# EAGLE design untitled (EAGLE 6.1)
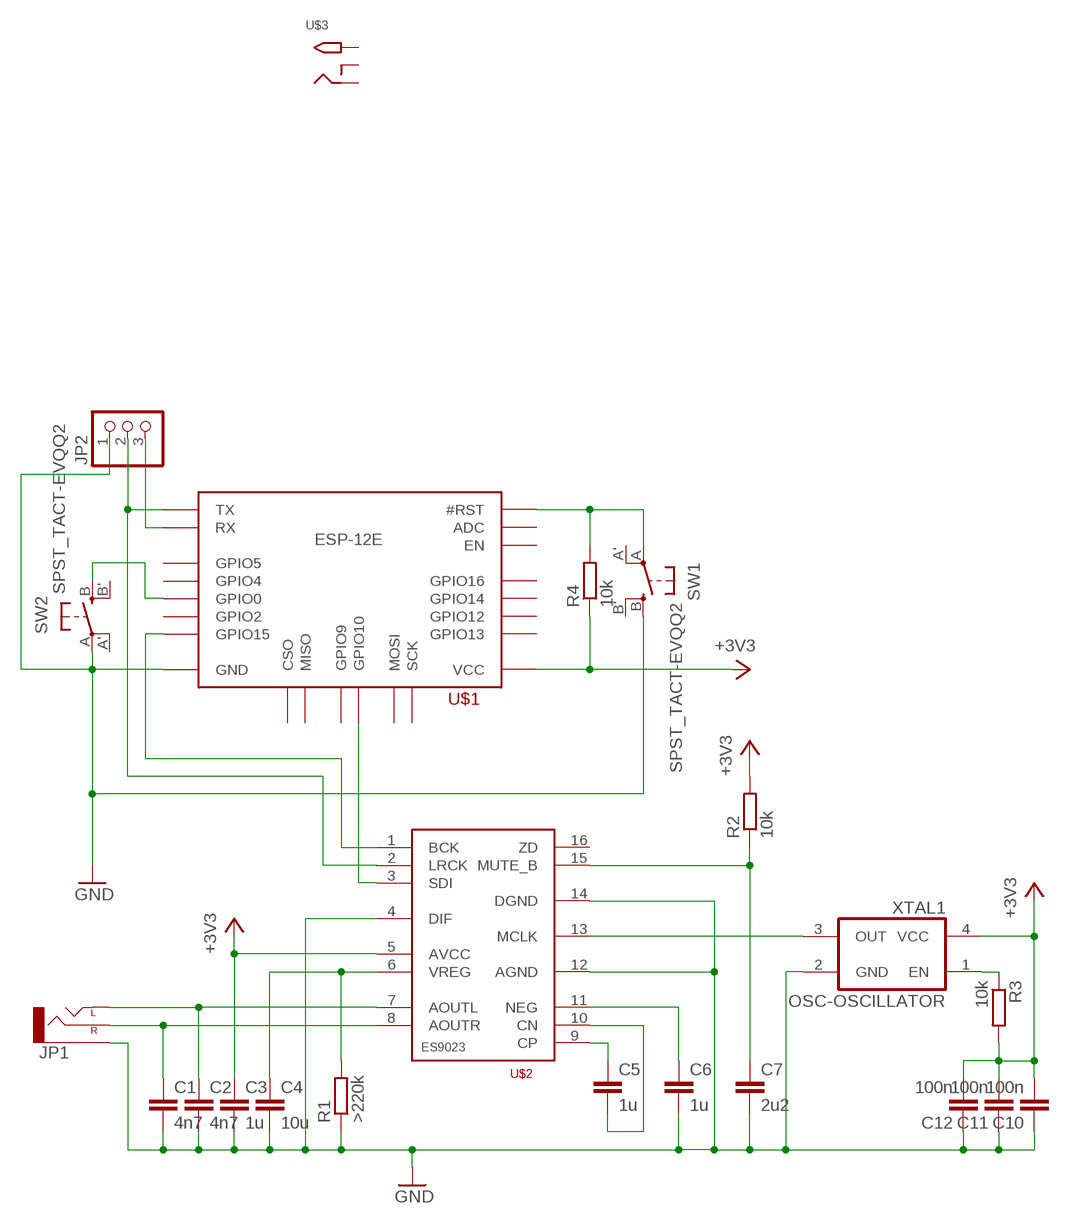
[diagram p0: schematic, sheet 1]

## Parts
C1  4n7  C-EUC0805K  [C0805K]
C2  4n7  C-EUC0805K  [C0805K]
C3  1u  C-EUC0805K  [C0805K]
C4  10u  C-EUC0805K  [C0805K]
C5  1u  C-EUC0805K  [C0805K]
C6  1u  C-EUC0805K  [C0805K]
C7  2u2  C-EUC0805K  [C0805K]
C10  100n  C-EUC0805K  [C0805K]
C11  100n  C-EUC0805K  [C0805K]
C12  100n  C-EUC0805K  [C0805K]
JP1  AUDIO-JACKPIN-HOLES  [AUDIO-JACK-HOLES]
JP2  PINHD-1X3  [1X03]
R1  >220k  R-EU_M0805  [M0805]
R2  10k  R-EU_M0805  [M0805]
R3  10k  R-EU_M0805  [M0805]
R4  10k  R-EU_M0805  [M0805]
SW1  SPST_TACT-EVQQ2  [EVQ-Q2]
SW2  SPST_TACT-EVQQ2  [EVQ-Q2]
U$1  ESP-07/12_ESP-12E  [ESP-07/12]
U$2  ES9023-SMD  [SOP16]
U$3  2.1MMJACKTHM  [PJ-102A]
XTAL1  OSC-OSCILLATOR  [OSCILLATOR_7X5_SMD]

## Nets
+3V3: C3.1 C10.2 C11.2 C12.2 R2.2 R3.2 R4.1 U$1.VCC U$2.5(AVCC) XTAL1.4(VCC)
GND: C1.2 C2.2 C3.2 C4.2 C6.2 C7.2 C10.1 C11.1 C12.1 JP1.GND(SLEEVE) JP2.1 R1.1 SW1.B(S) SW2.A(P) U$1.GND U$2.4(DIF) U$2.12(AGND) U$2.14(DGND) XTAL1.2(GND)
N$1: R3.1 XTAL1.1(EN)
N$2: R4.2 SW1.A(P) U$1.REST(#RST)
N$3: C4.1 R1.2 U$2.6(VREG)
N$4: C5.1 U$2.9(CP)
N$5: C5.2 U$2.10(CN)
N$6: C6.1 U$2.11(NEG)
N$7: C7.1 R2.1 U$2.15(MUTE_B)
N$8: SW2.B(S) U$1.GPIO0
N$9: U$1.GPIO15 U$2.1(BCK)
N$10: C1.1 JP1.R+(RIGHT) U$2.8(AOUTR)
N$11: C2.1 JP1.L1-(LEFT) JP1.L2-(LEFT) U$2.7(AOUTL)
N$12: JP2.2 U$1.TXD0(TX) U$2.2(LRCK)
N$13: JP2.3 U$1.RXD0(RX)
N$14: U$1.GPIO10 U$2.3(SDI)
N$15: U$2.13(MCLK) XTAL1.3(OUT)
Unconnected: SW1.A'(P1) SW1.B'(S1) SW2.A'(P1) SW2.B'(S1) U$1.ADC U$1.CSO U$1.EN U$1.GPIO2 U$1.GPIO4 U$1.GPIO5 U$1.GPIO9 U$1.GPIO12 U$1.GPIO13 U$1.GPIO14 U$1.GPIO16 U$1.MISO U$1.MOSI U$1.SCLK(SCK) U$2.16(ZD) U$3.RING U$3.RING_SW U$3.TIP

## Library data of the parts
C1-C7 C10-C12 = rcl:C-EU: CAPACITOR, European symbol
JP1 = _MY_OWN_LIB:AUDIO-JACK: 3.5mm Audio Jack Simple 3.5mm common PCB mount audio jack. SKU: PRT-08032
JP2 = pinhead:PINHD-1X3: PIN HEADER
R1-R4 = rcl:R-EU_: RESISTOR, European symbol
SW1 SW2 = adafruit:SPST_TACT: SMT 6mm switch, EVQQ2 series http://www.ladyada.net/library/eagle
U$1 = _MY_OWN_LIB:ESP-07/12: Version 1.0 of the library for the ESP-07/12 full GPIO dev board module byME Jon jonnyradu@gmail.com
U$2 = _MY_OWN_LIB:ES9023
U$3 = adafruit:2.1MMJACK: 2.1mm x 5.5mm THM DC jack with internal switch. Digikey part #PJ-102A, 4UCON part #05537 2.1mm x 5.5mm SMT DC jack with internal switch. Digikey part #PJ-002A-SMT, 4UCON part #03267 By microbuilder.eu & adafruit.com
XTAL1 = dp_devices:OSC-OSCILLATOR: Oscillator

## Board
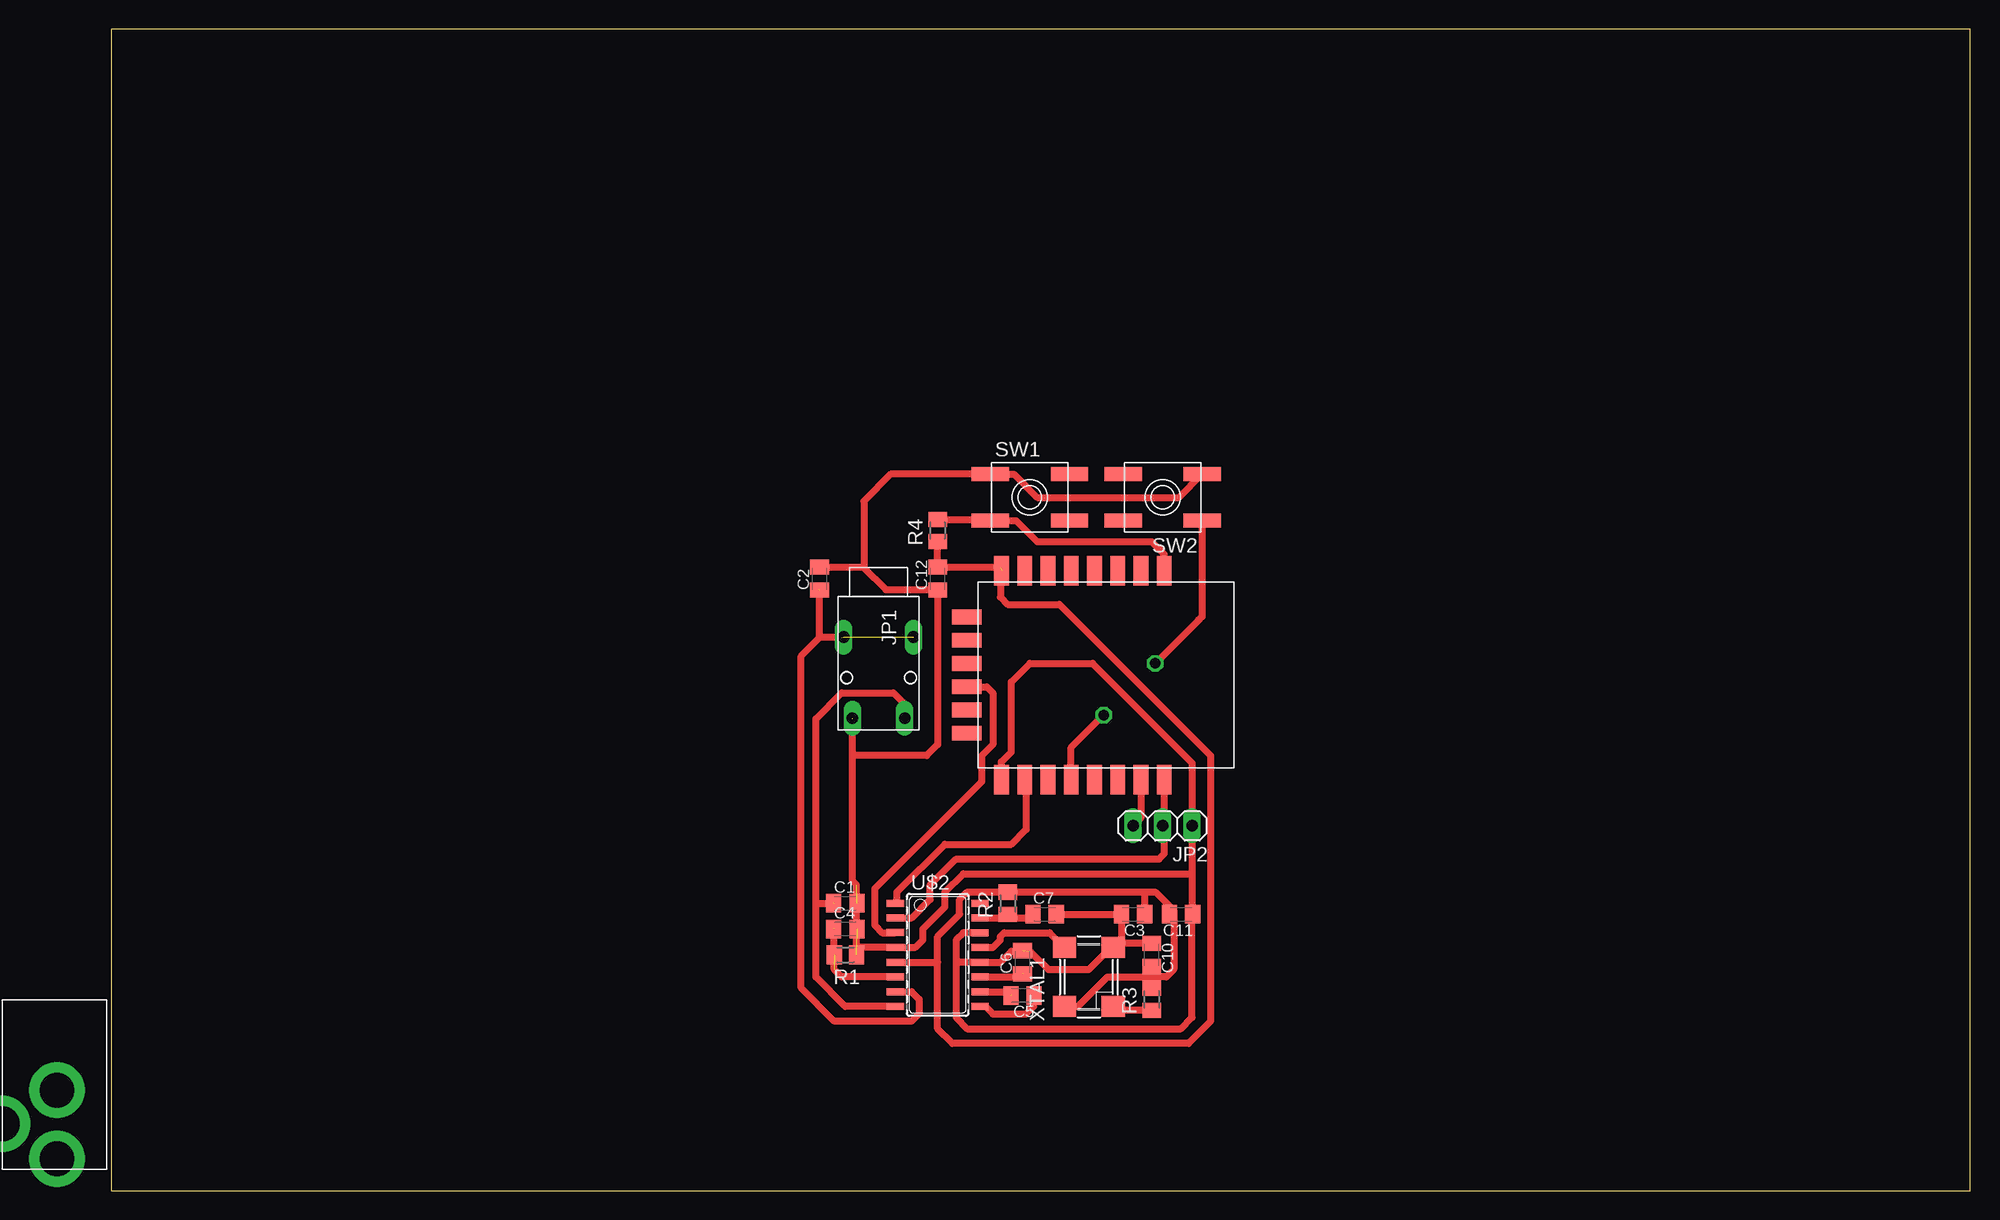
[diagram p1: board, top side]
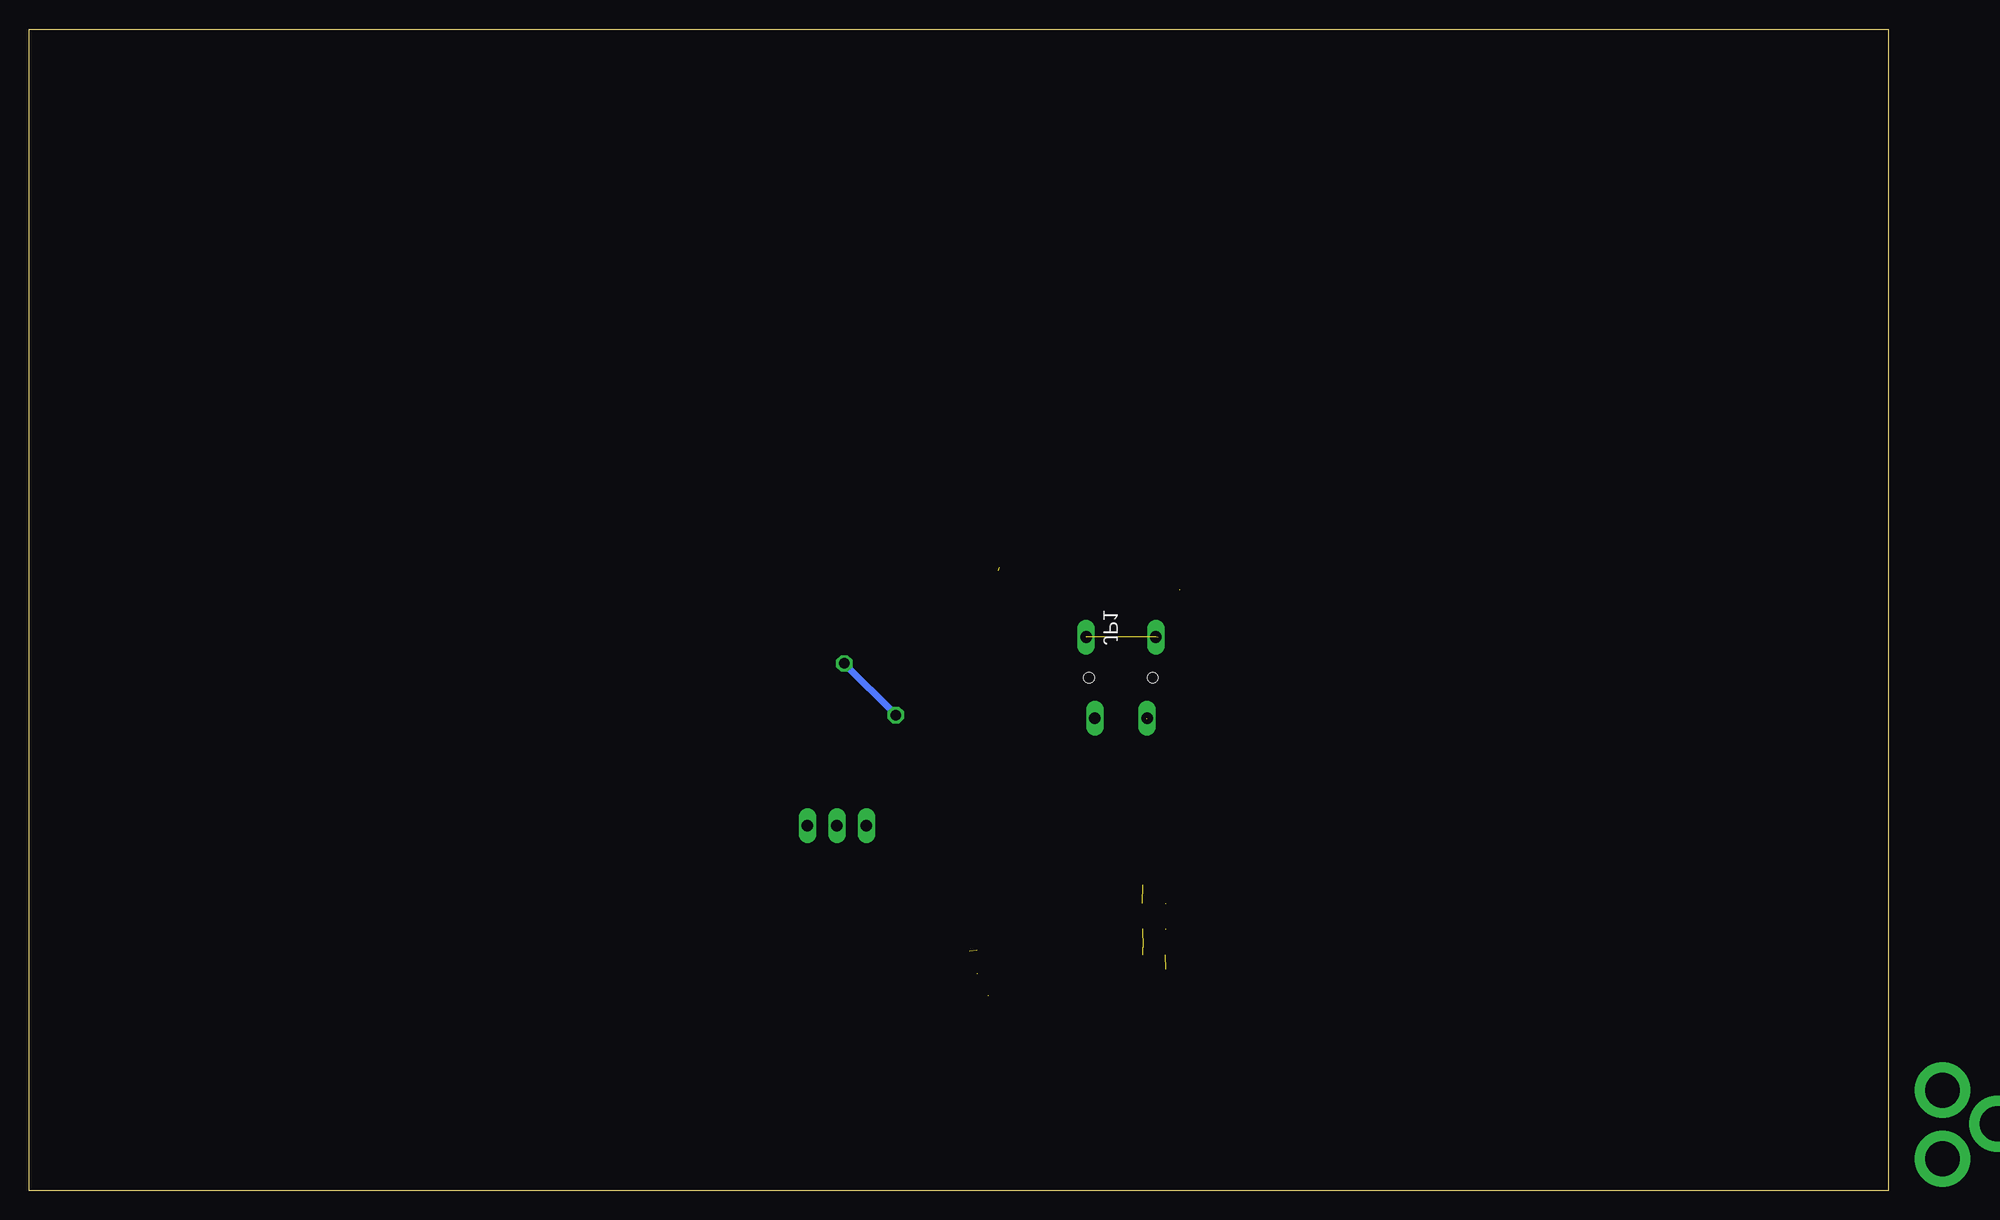
[diagram p2: board, bottom side, seen from below]

Size 160 x 100 mm. Coordinates in mm from the lower left corner, seen from the top.
Outline: 0,0 160,0 160,100 0,100 0,0
Copper layers (1*16): Top 0.035mm / dielectric 1.5mm / Bottom 0.035mm
Design rules: minimum track width 10mil, minimum drill 24mil, track to track 12mil, track to pad 12mil, pad to pad 12mil, via to via 12mil, smd to smd 10mil, copper to edge 12mil, drill to drill 12mil, minimum pad ring 10mil, minimum via ring 10mil, stop-mask expansion 4mil, vias tented up to drill 0mil, thermal gap 12mil

### Footprints (pad centres in the part's own frame; a part is rotated, then mirrored left to right if it is on the bottom)
C0805K = smd 1.3 x 1.6: 1 -1,0; 2 1,0
AUDIO-JACK-HOLES = drill 1 pad 1.32 long: GND 6,-2.25; L1- -1,-3; L2- -1,3; R+ 6,2.25 | hole 0.9: 2.5,2.75; 2.5,-2.75
1X03 = drill 1.016 long: 1 -2.54,0; 2 0,0; 3 2.54,0
M0805 = smd 1.3 x 1.6: 1 -0.95,0; 2 0.95,0
EVQ-Q2 = smd 3.2 x 1.2: A -3.4,-2; A' 3.4,-2; B -3.4,2; B' 3.4,2
ESP-07/12 = smd 2.54 x 1.27: ADC -1,14; EN -1,12; GND 17,2; GPIO0 17,8; GPIO2 17,6; GPIO4 17,10; GPIO5 17,12; GPIO12 -1,6; GPIO13 -1,4; GPIO14 -1,8; GPIO15 17,4; GPIO16 -1,10; REST -1,16; RXD0 17,14; TXD0 17,16; VCC -1,2 | smd 1.27 x 2.54: CSO 3,-1; GPIO9 7,-1; GPIO10 9,-1; MISO 5,-1; MOSI 11,-1; SCLK 13,-1
SOP16 = smd 0.6 x 1.5: 1 -4.445,-3.65; 2 -3.185,-3.65; 3 -1.915,-3.65; 4 -0.645,-3.65; 5 0.635,-3.65; 6 1.895,-3.65; 7 3.165,-3.65; 8 4.435,-3.65; 9 4.445,3.65; 10 3.175,3.65; 11 1.905,3.65; 12 0.635,3.65; 13 -0.635,3.65; 14 -1.905,3.65; 15 -3.175,3.65; 16 -4.445,3.65
PJ-102A = drill 3 pad 4.8: RING 0.1,-3.39; RING_SW -4.6,-6.29; TIP 0.1,-9.29
OSCILLATOR_7X5_SMD = smd 1.8 x 2: 1 -2.54,-2.1; 2 2.54,-2.1; 3 2.54,2.1; 4 -2.54,2.1

### Placement (x,y rotation side)
C1  63.18,24.77 0 top
C2  60.96,52.7 90 top
C3  87.95,23.81 180 top
C4  63.18,22.54 0 top
C5  78.42,16.83 180 top
C6  78.42,19.68 90 top
C7  80.33,23.81 0 top
C10  89.53,20.32 270 top
C11  92.08,23.81 180 top
C12  71.12,52.7 90 top
JP1  66.04,46.67 270 top
JP2  90.49,31.43 180 top
R1  63.18,20.32 180 top
R2  77.15,24.77 90 top
R3  89.53,16.51 90 top
R4  71.12,56.83 90 top
SW1  79.06,59.69 0 top
SW2  90.49,59.69 180 top
U$1  74.61,52.39 270 top
U$2  71.12,20.32 270 top
U$3  -4.76,12.06 0 top  (outside the outline)
XTAL1  84.14,18.41 90 top

### Tracks (layer width: path | path; a pad name or v marks a point on that pad's centre or on a via)
+3V3  (1 unrouted)
  Top 0.61: C10.2 89.53,18.41 | 89.53,18.41 R3.2 | XTAL1.4 83.19,15.88 85.72,18.41 89.53,18.41 | 88.9,25.72 89.85,25.72 91.44,24.13 | 91.44,24.13 91.44,19.05 90.81,18.41 89.53,18.41 | C3.1 88.95,25.67 88.9,25.72 | 88.9,25.71 88.9,25.72 | R2.2 73.66,25.71 73.66,25.72 | C11.2 91.12,23.81 91.44,24.13 | U$2.5 71.12,19.68 | 73.66,25.72 73.03,25.08 73.03,23.81 71.12,21.91 71.12,19.68 | 73.66,25.72 88.9,25.72 | 71.12,19.68 71.12,13.97 72.39,12.7 92.71,12.7 94.61,14.61 94.61,37.47 81.6,50.48 77.15,50.48 76.52,51.12 76.52,53.66 76.47,53.7 C12.2 R4.1
GND  (5 unrouted)
  Top 0.61: 72.71,19.68 U$2.12 76.52,19.68 77.47,20.64 79.06,20.64 80.64,19.05 84.14,19.05 86.04,20.95 XTAL1.2 | U$2.14 73.34,22.23 72.71,21.59 72.71,19.68 | XTAL1.2 86.95,21.03 C3.2 C7.2 | C10.1 87.24,21.32 XTAL1.2 | U$1.GND 76.61,36.92 77.47,37.78 77.47,43.81 79.06,45.4 84.45,45.4 93.03,36.83 JP2.1 93.03,27.3 | 93.03,27.3 93.03,23.81 C11.1 93.03,23.77 93.03,14.92 92.08,13.97 73.66,13.97 72.71,14.92 72.71,19.68 | 93.03,27.3 73.34,27.3 71.75,25.72 71.75,24.45 69.85,22.54 69.85,21.59 69.22,20.96 U$2.4 64.14,20.96 64.14,20.95 64.14,26.35 63.82,26.67 63.82,37.47 | 71.07,51.75 C12.1 71.12,38.42 70.17,37.47 63.82,37.47 | C2.2 64.72,53.7 | 64.72,53.7 66.67,51.75 71.07,51.75 | 71.07,51.75 71.12,51.75 | SW2.A 91.89,59.69 79.69,59.69 77.69,61.69 SW1.B 67.09,61.69 64.77,59.37 64.77,53.75 64.72,53.7 | 63.82,37.47 63.82,40.64
N$1
  Top 0.61: R3.1 87.19,15.56 XTAL1.1
N$2
  Top 0.61: R4.2 75.56,57.78 SW1.A 77.88,57.69 79.69,55.88 89.53,55.88 90.61,54.8 U$1.REST
N$3  (2 unrouted)
  Top 0.61: U$2.6 62.85,18.43 62.23,19.05 62.23,22.54
N$4
  Top 0.61: U$2.9 75.25,15.88 75.88,15.24 78.74,15.24 79.38,15.88 79.38,16.78 C5.1
N$5  (1 unrouted)
  Top 0.61: U$2.10 77.15,17.14 77.47,16.83
N$6  (1 unrouted)
  Top 0.61: U$2.11 78.11,18.41 78.42,18.73
N$7
  Top 0.61: U$2.15 77.15,23.5 | 77.15,23.5 79.38,23.5 79.38,23.77 C7.1 | R2.1 77.15,23.5
N$8  (via drill 0.9)
  Top 0.61: U$1.GPIO0 82.61,38.16 v85.41,40.96 | v89.85,45.4 93.5,49.05 93.66,49.21 93.89,49.44 SW2.B
  Bottom 0.61: v85.41,40.96 v89.85,45.4
N$9
  Top 0.61: U$2.1 67.63,24.77 67.63,25.72 71.75,29.84 77.47,29.84 78.74,31.11 78.74,35.26 U$1.GPIO15
N$10  (1 unrouted)
  Top 0.61: JP1.R+ 68.26,40.7 68.26,41.91 67.31,42.86 62.87,42.86 60.64,40.64 60.64,24.77 | U$2.8 63.17,15.88 60.64,18.41 60.64,24.77 | 60.64,24.77 62.23,24.77
N$11  (3 unrouted)
  Top 0.61: U$2.7 68.89,17.16 69.53,16.51 69.53,15.24 68.9,14.61 62.23,14.61 59.37,17.46 59.37,46.04 60.96,47.62 | 60.64,51.44 60.96,51.75 60.96,47.62 | 62.87,47.62 60.96,47.62
N$12
  Top 0.61: U$2.2 68.91,23.5 70.48,25.08 70.48,26.35 72.71,28.57 90.17,28.57 90.61,29.02 90.61,31.43 | U$1.TXD0 90.61,31.43 | JP2.2 90.61,31.43
N$13
  Top 0.61: U$1.RXD0 88.61,32.1 JP2.3
N$14
  Top 0.61: U$1.GPIO10 75.36,43.39 75.88,42.86 75.88,38.42 74.93,37.47 74.93,35.24 65.72,26.04 65.72,22.86 66.36,22.23 U$2.3
N$15
  Top 0.61: U$2.13 75.88,20.95 76.52,21.59 76.52,21.91 76.83,22.23 80.77,22.23 XTAL1.3